# Altium project Multimeter-PCB.PrjPcb
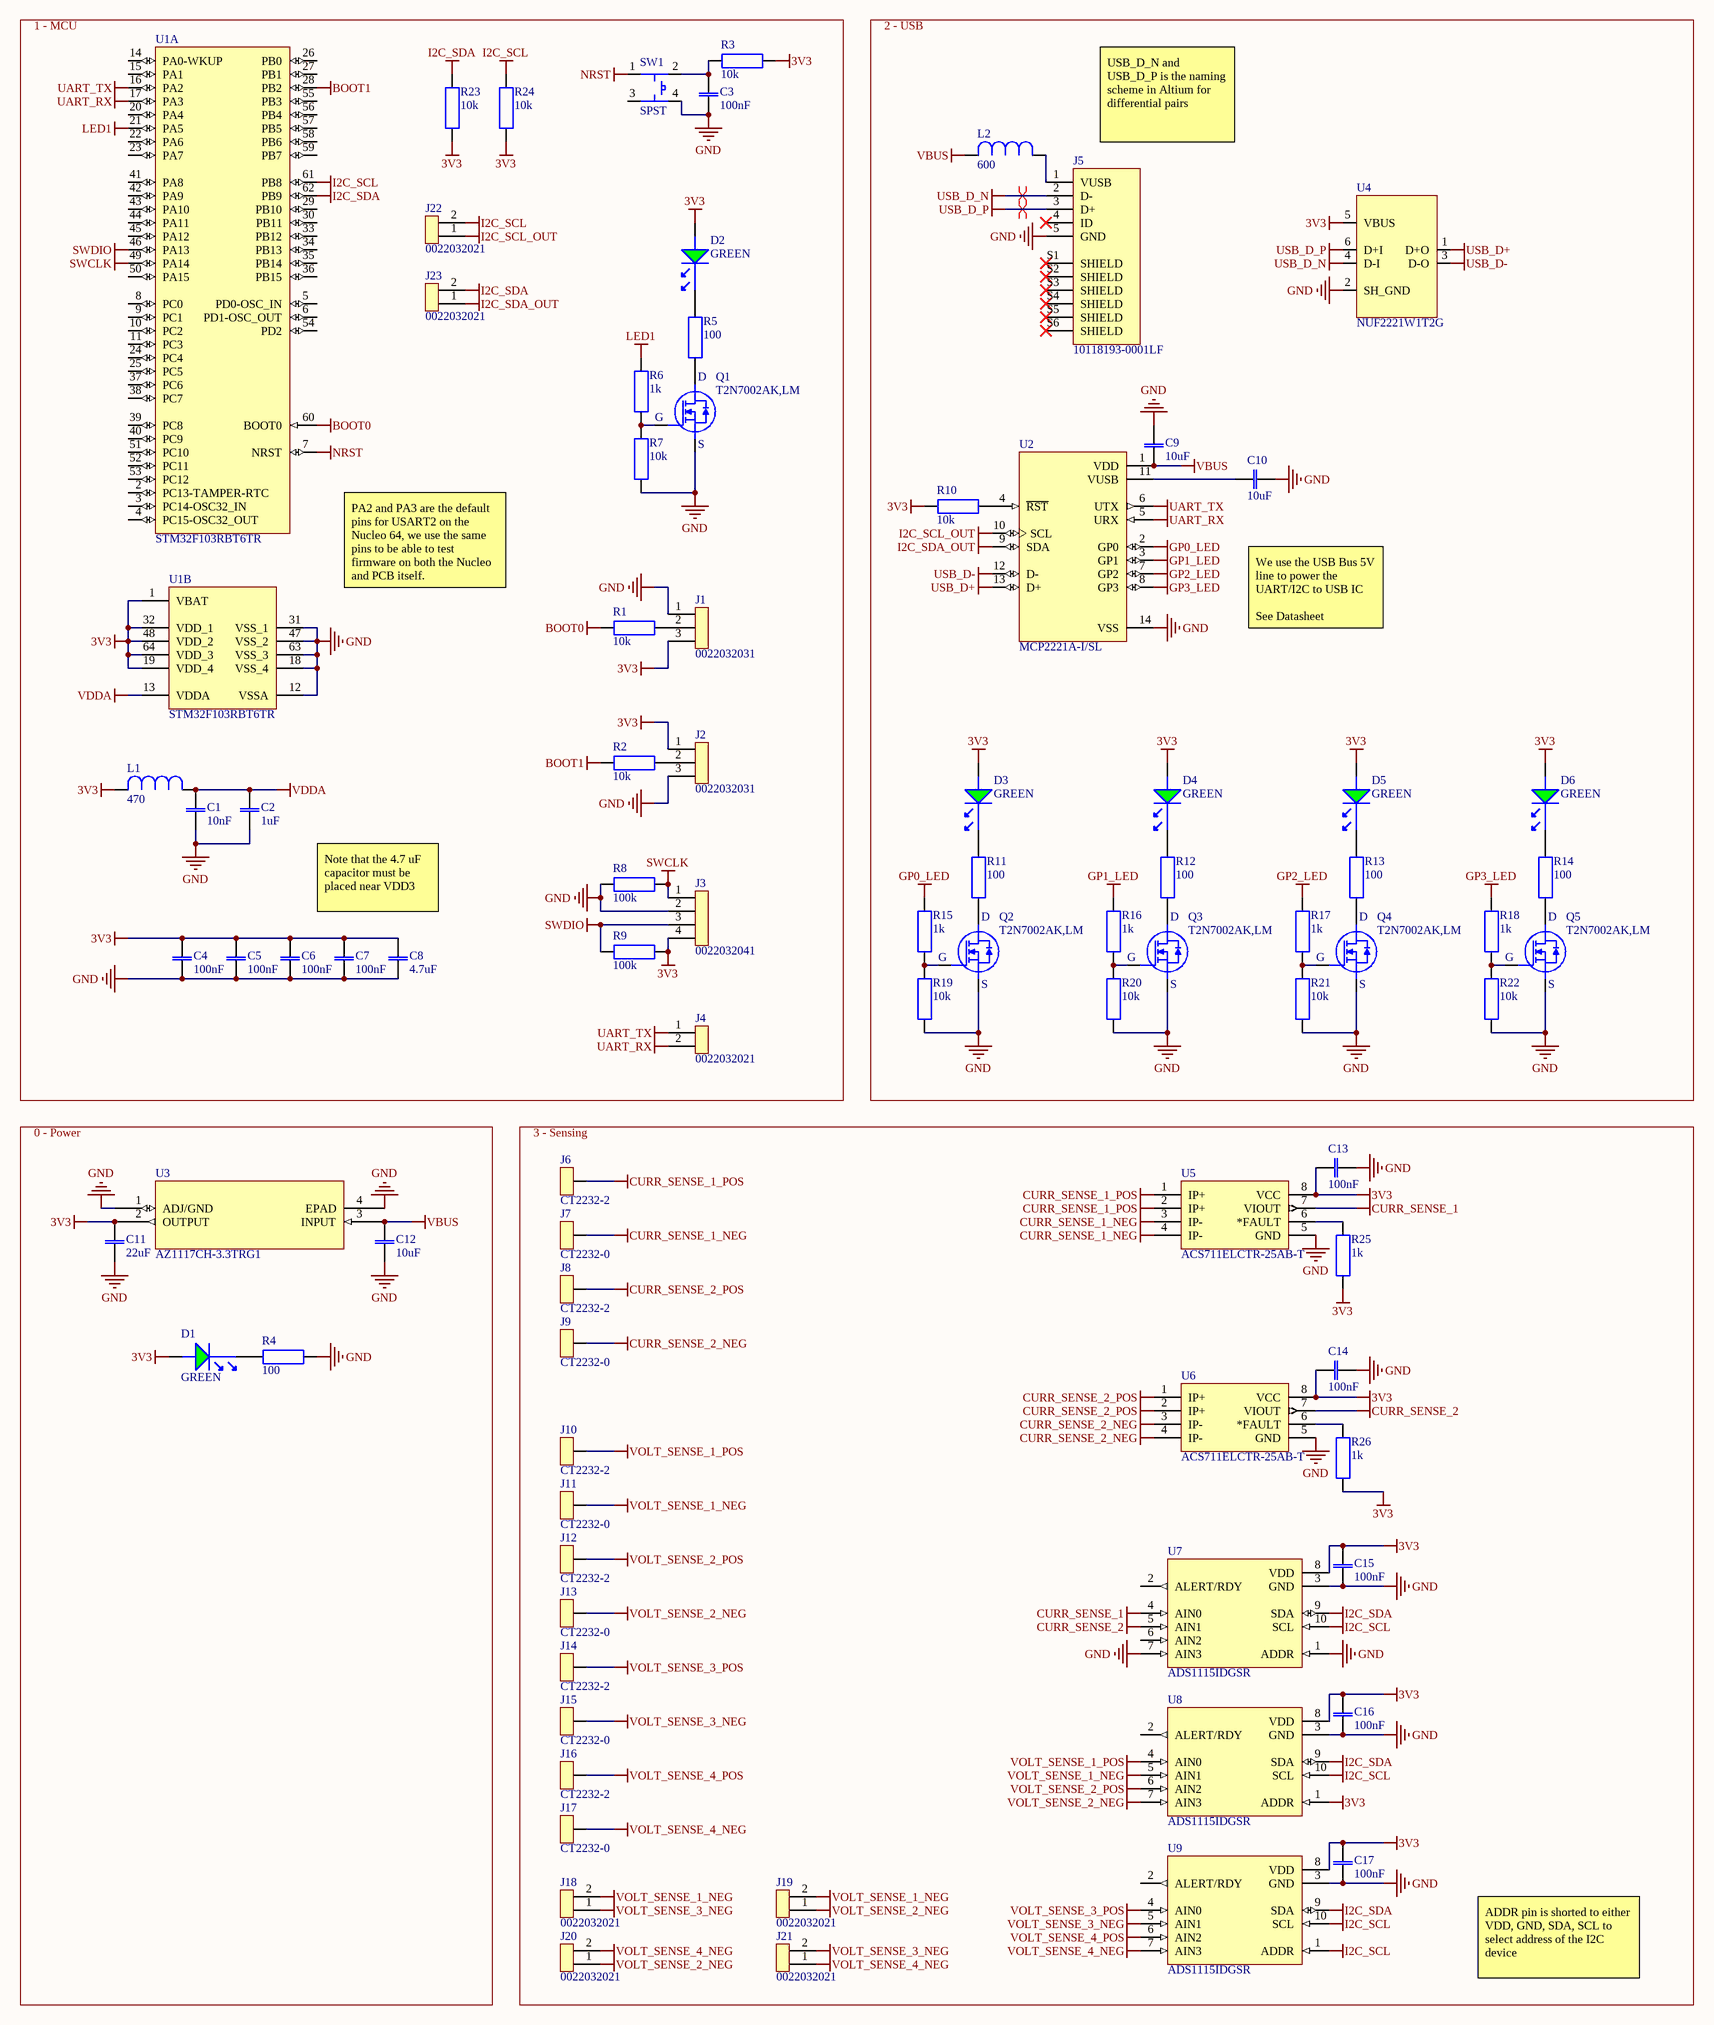
[diagram p0: Multimeter_Schematic.SchDoc]
1 sheet, 89 parts. Net scope: global (net labels, ports and power ports of the same name join across sheets).
Board file: Multimeter_Schematic.PcbDoc

## Sheet Multimeter_Schematic.SchDoc
size A2; SheetNumber: 1; SheetTotal: 1

### Parts
C1  10nF  [CAP_CC0805_YAG]
C2  1uF  [CAP_CC0805_YAG]
C3  100nF  [CAP_CC0805_YAG]
C4  100nF  [CAP_CC0805_YAG]
C5  100nF  [CAP_CC0805_YAG]
C6  100nF  [CAP_CC0805_YAG]
C7  100nF  [CAP_CC0805_YAG]
C8  4.7uF  [CAP_CC0805_YAG]
C9  10uF  [CAP_CC0805_YAG]
C10  10uF  [CAP_CC0805_YAG]
C11  22uF  [CAP_CC0805_YAG]
C12  10uF  [CAP_CC0805_YAG]
C13  100nF  [CAP_CC0805_YAG]
C14  100nF  [CAP_CC0805_YAG]
C15  100nF  [CAP_CC0805_YAG]
C16  100nF  [CAP_CC0805_YAG]
C17  100nF  [CAP_CC0805_YAG]
D1  GREEN  [LTST-C170TGKT]
D2  GREEN  [LTST-C170TGKT]
D3  GREEN  [LTST-C170TGKT]
D4  GREEN  [LTST-C170TGKT]
D5  GREEN  [LTST-C170TGKT]
D6  GREEN  [LTST-C170TGKT]
J1  0022032031  [CONN3X1_22032031_MOL]
J2  0022032031  [CONN3X1_22032031_MOL]
J3  0022032041  [CONN3X1_22032041_MOL]
J4  0022032021  [CONN3X1_22032021_MOL]
J5  10118193-0001LF  [AMPHENOL_10118193-0001LF]
J6  CT2232-2  [CT2232-2]
J7  CT2232-0  [CT2232-0]
J8  CT2232-2  [CT2232-2]
J9  CT2232-0  [CT2232-0]
J10  CT2232-2  [CT2232-2]
J11  CT2232-0  [CT2232-0]
J12  CT2232-2  [CT2232-2]
J13  CT2232-0  [CT2232-0]
J14  CT2232-2  [CT2232-2]
J15  CT2232-0  [CT2232-0]
J16  CT2232-2  [CT2232-2]
J17  CT2232-0  [CT2232-0]
J18  0022032021  [CONN3X1_22032021_MOL]
J19  0022032021  [CONN3X1_22032021_MOL]
J20  0022032021  [CONN3X1_22032021_MOL]
J21  0022032021  [CONN3X1_22032021_MOL]
J22  0022032021  [CONN3X1_22032021_MOL]
J23  0022032021  [CONN3X1_22032021_MOL]
L1  470  [IND_HZ0805G471R-10]
L2  600  [IND_HZ0805G471R-10]
Q1  T2N7002AK,LM  [T2N7002AK,LM]
Q2  T2N7002AK,LM  [T2N7002AK,LM]
Q3  T2N7002AK,LM  [T2N7002AK,LM]
Q4  T2N7002AK,LM  [T2N7002AK,LM]
Q5  T2N7002AK,LM  [T2N7002AK,LM]
R1  10k  [RESC2012X60N]
R2  10k  [RESC2012X60N]
R3  10k  [RESC2012X60N]
R4  100  [RESC2012X60N]
R5  100  [RESC2012X60N]
R6  1k  [RESC2012X60N]
R7  10k  [RESC2012X60N]
R8  100k  [RESC2012X60N]
R9  100k  [RESC2012X60N]
R10  10k  [RESC2012X60N]
R11  100  [RESC2012X60N]
R12  100  [RESC2012X60N]
R13  100  [RESC2012X60N]
R14  100  [RESC2012X60N]
R15  1k  [RESC2012X60N]
R16  1k  [RESC2012X60N]
R17  1k  [RESC2012X60N]
R18  1k  [RESC2012X60N]
R19  10k  [RESC2012X60N]
R20  10k  [RESC2012X60N]
R21  10k  [RESC2012X60N]
R22  10k  [RESC2012X60N]
R23  10k  [RESC2012X60N]
R24  10k  [RESC2012X60N]
R25  1k  [RESC2012X60N]
R26  1k  [RESC2012X60N]
SW1  SPST  [SW4-SMD-5.2X5.2X1.5MM]
U1  STM32F103RBT6TR  [STM-LQFP64_V]  (parts A,B of 2)
U2  MCP2221A-I/SL  [SOIC127P600X175-14N]
U3  AZ1117CH-3.3TRG1  [SOT-223_DIO]
U4  NUF2221W1T2G  [SOT-363]
U5  ACS711ELCTR-25AB-T  [SOICN-8_ALM]
U6  ACS711ELCTR-25AB-T  [SOICN-8_ALM]
U7  ADS1115IDGSR  [SOP50P490X110-10N]
U8  ADS1115IDGSR  [SOP50P490X110-10N]
U9  ADS1115IDGSR  [SOP50P490X110-10N]

### Blocks framed on the sheet
1 - MCU: C1-C8 D2 J1-J4 J22 J23 L1 Q1 R1-R3 R5-R9 R23 R24 SW1 U1
2 - USB: C9 C10 D3-D6 J5 L2 Q2-Q5 R10-R22 U2 U4
0 - Power: C11 C12 D1 R4 U3
3 - Sensing: C13-C17 J6-J21 R25 R26 U5-U9

### Nets
3V3: C4.2 C5.1 C6.1 C7.1 C8.2 C11.2 C13.2 C14.2 C15.2 C16.2 C17.2 D1.1 D2.1 D3.1 D4.1 D5.1 D6.1 J1.3 J2.1 J3.4 L1.2 R3.2 R9.1 R10.1 R23.2 R24.1 R25.1 R26.1 U1.1(VBAT) U1.19(VDD_4) U1.32(VDD_1) U1.48(VDD_2) U1.64(VDD_3) U3.2(OUTPUT) U4.5(VBUS) U5.8(VCC) U6.8(VCC) U7.8(VDD) U8.1(ADDR) U8.8(VDD) U9.8(VDD)
BOOT0: R1.1 U1.60(BOOT0)
BOOT1: R2.1 U1.28(PB2)
CURR_SENSE_1: U5.7(VIOUT) U7.4(AIN0)
CURR_SENSE_1_NEG: J7.1 U5.3(IP-) U5.4(IP-)
CURR_SENSE_1_POS: J6.1 U5.1(IP+) U5.2(IP+)
CURR_SENSE_2: U6.7(VIOUT) U7.5(AIN1)
CURR_SENSE_2_NEG: J9.1 U6.3(IP-) U6.4(IP-)
CURR_SENSE_2_POS: J8.1 U6.1(IP+) U6.2(IP+)
GND: C1.1 C2.1 C3.1 C4.1 C5.2 C6.2 C7.2 C8.1 C9.2 C10.2 C11.1 C12.1 C13.1 C14.1 C15.1 C16.1 C17.1 J1.1 J2.3 J3.2 J5.5(GND) Q1.2 Q2.2 Q3.2 Q4.2 Q5.2 R4.1 R7.1 R8.2 R19.1 R20.1 R21.1 R22.1 SW1.4 U1.12(VSSA) U1.18(VSS_4) U1.31(VSS_1) U1.47(VSS_2) U1.63(VSS_3) U2.14(VSS) U3.1(ADJ/GND) U3.4(EPAD) U4.2(SH_GND) U5.5(GND) U6.5(GND) U7.1(ADDR) U7.3(GND) U7.7(AIN3) U8.3(GND) U9.3(GND)
GP0_LED: R15.2 U2.2(GP0)
GP1_LED: R16.2 U2.3(GP1)
GP2_LED: R17.2 U2.7(GP2)
GP3_LED: R18.2 U2.8(GP3)
I2C_SCL: J22.2 R24.2 U1.61(PB8) U7.10(SCL) U8.10(SCL) U9.1(ADDR) U9.10(SCL)
I2C_SCL_OUT: J22.1 U2.10(SCL)
I2C_SDA: J23.2 R23.1 U1.62(PB9) U7.9(SDA) U8.9(SDA) U9.9(SDA)
I2C_SDA_OUT: J23.1 U2.9(SDA)
LED1: R6.2 U1.21(PA5)
NRST: SW1.1 U1.7(NRST)
SWCLK: J3.1 R8.1 U1.49(PA14)
SWDIO: J3.3 R9.2 U1.46(PA13)
UART_RX: J4.2 U1.17(PA3) U2.5(URX)
UART_TX: J4.1 U1.16(PA2) U2.6(UTX)
USB_D+: U2.13(D+) U4.1(D+O)
USB_D-: U2.12(D-) U4.3(D-O)
USB_D_N: J5.2(D-) U4.4(D-I)
USB_D_P: J5.3(D+) U4.6(D+I)
VBUS: C9.1 C12.2 L2.2 U2.1(VDD) U3.3(INPUT)
VDDA: C1.2 C2.2 L1.1 U1.13(VDDA)
VOLT_SENSE_1_NEG: J11.1 J18.2 J19.2 U8.5(AIN1)
VOLT_SENSE_1_POS: J10.1 U8.4(AIN0)
VOLT_SENSE_2_NEG: J13.1 J19.1 J20.1 U8.7(AIN3)
VOLT_SENSE_2_POS: J12.1 U8.6(AIN2)
VOLT_SENSE_3_NEG: J15.1 J18.1 J21.2 U9.5(AIN1)
VOLT_SENSE_3_POS: J14.1 U9.4(AIN0)
VOLT_SENSE_4_NEG: J17.1 J20.2 J21.1 U9.7(AIN3)
VOLT_SENSE_4_POS: J16.1 U9.6(AIN2)
NetC3_2: C3.2 R3.1 SW1.2
NetC10_1: C10.1 U2.11(VUSB)
NetD1_2: D1.2 R4.2
NetD2_2: D2.2 R5.2
NetD3_2: D3.2 R11.2
NetD4_2: D4.2 R12.2
NetD5_2: D5.2 R13.2
NetD6_2: D6.2 R14.2
NetJ1_2: J1.2 R1.2
NetJ2_2: J2.2 R2.2
NetJ5_1: J5.1(VUSB) L2.1
NetQ1_1: Q1.1 R6.1 R7.2
NetQ1_3: Q1.3 R5.1
NetQ2_1: Q2.1 R15.1 R19.2
NetQ2_3: Q2.3 R11.1
NetQ3_1: Q3.1 R16.1 R20.2
NetQ3_3: Q3.3 R12.1
NetQ4_1: Q4.1 R17.1 R21.2
NetQ4_3: Q4.3 R13.1
NetQ5_1: Q5.1 R18.1 R22.2
NetQ5_3: Q5.3 R14.1
NetR10_2: R10.2 U2.4(~{RST})
NetR25_2: R25.2 U5.6(*FAULT)
NetR26_2: R26.2 U6.6(*FAULT)

Not connected (* = marked no-connect by the designer): J5 4(ID)* S1(SHIELD)* S2(SHIELD)* S3(SHIELD)* S4(SHIELD)* S5(SHIELD)* S6(SHIELD)*; SW1 3; U1 2(PC13-TAMPER-RTC) 3(PC14-OSC32_IN) 4(PC15-OSC32_OUT) 5(PD0-OSC_IN) 6(PD1-OSC_OUT) 8(PC0) 9(PC1) 10(PC2) 11(PC3) 14(PA0-WKUP) 15(PA1) 20(PA4) 22(PA6) 23(PA7) 24(PC4) 25(PC5) 26(PB0) 27(PB1) 29(PB10) 30(PB11) 33(PB12) 34(PB13) 35(PB14) 36(PB15) 37(PC6) 38(PC7) 39(PC8) 40(PC9) 41(PA8) 42(PA9) 43(PA10) 44(PA11) 45(PA12) 50(PA15) 51(PC10) 52(PC11) 53(PC12) 54(PD2) 55(PB3) 56(PB4) 57(PB5) 58(PB6) 59(PB7); U7 2(ALERT/RDY) 6(AIN2); U8 2(ALERT/RDY); U9 2(ALERT/RDY)

### Layout directives
differential pair: USB_D_N, USB_D_P

### Notes on the sheet
- USB_D_N and USB_D_P is the naming scheme in Altium for differential pairs
- PA2 and PA3 are the default pins for USART2 on the Nucleo 64, we use the same pins to be able to test firmware on both the Nucleo and PCB itself.
- We use the USB Bus 5V line to power the UART/I2C to USB IC
  See Datasheet
- Note that the 4.7 uF capacitor must be placed near VDD3
- ADDR pin is shorted to either VDD, GND, SDA, SCL to select address of the I2C device
- (in symbol T2N7002AK,LM) D; G; S

### Library data of the parts
C1 = CC0805KRX7R8BB103: 10000 pF ±10% 25V Ceramic Capacitor X7R 0805 (2012 Metric); Manufacturer: YAGEO; Supplier: Digikey; Supplier Part Number: 311-3579-2-ND; Manufacturer Part Number: CC0805KRX7R8BB103
C2 = CC0805KKX7R8BB105: 1 µF ±10% 25V Ceramic Capacitor X7R 0805 (2012 Metric); Manufacturer: YAGEO; Supplier: Digikey; Supplier Part Number: 311-1456-2-ND; Manufacturer Part Number: CC0805KKX7R8BB105
C3-C7 C13-C17 = CC0805KRX7R8BB104: 0.1 µF ±10% 25V Ceramic Capacitor X7R 0805 (2012 Metric); Manufacturer: YAGEO; Supplier: Digikey; Supplier Part Number: 311-1141-2-ND; Manufacturer Part Number: CC0805KRX7R8BB104
C8 = CC0805KKX7R8BB475: 4.7 µF ±10% 25V Ceramic Capacitor X7R 0805 (2012 Metric); Manufacturer: YAGEO; Supplier: Digikey; Supplier Part Number: 311-1885-2-ND; Manufacturer Part Number: CC0805KKX7R8BB475
C9 C10 C12 = CC0805KKX5R8BB106: 10 µF ±10% 25V Ceramic Capacitor X5R 0805 (2012 Metric); Manufacturer: YAGEO; Supplier: Digikey; Supplier Part Number: 311-1869-2-ND; Manufacturer Part Number: CC0805KKX5R8BB106
C11 = CC0805MKX5R8BB226: 22 µF ±20% 25V Ceramic Capacitor X5R 0805 (2012 Metric); Manufacturer: YAGEO; Supplier: Digikey; Supplier Part Number: 311-1903-2-ND; Manufacturer Part Number: CC0805MKX5R8BB226
D1-D6 = LTST-C170TGKT: Green 525nm LED Indication - Discrete 3.2V 0805 (2012 Metric); Manufacturer: Lite-On Inc.; ComponentLink1Description: Digikey; ComponentLink1URL: https://www.digikey.ca/en/products/detail/liteon/LTST-C190KFKT/386813; Supplier: Digikey; Supplier Part Number: 160-1887-2-ND; Manufacturer Part Number: LTST-C170TGKT
J1 J2 = 0022032031: Connector Header Through Hole 3 position 0.100" (2.54mm); Manufacturer: Molex; Supplier: Digikey; Supplier Part Number: 900-0022032031-ND; Manufacturer Part Number: 0022032031
J3 = 0022032041: Connector Header Through Hole 4 position 0.100" (2.54mm); Manufacturer: Molex; Supplier: Digikey; Supplier Part Number: WM4002-ND; Manufacturer Part Number: 0022032041
J4 J18-J23 = 0022032021: Connector Header Through Hole 2 position 0.100" (2.54mm); Manufacturer: Molex; Supplier: Digikey; Supplier Part Number: WM4000-ND; Manufacturer Part Number: 0022032021
J5 = 10118193-0001LF: USB - micro B USB 2.0 Receptacle Connector 5 Position Surface Mount, Right Angle; Through Hole; Manufacturer: Amphenol ICC (FCI); MF: Amphenol ICC; SnapEDA_Link: https://www.snapeda.com/parts/10118193-0001LF/Amphenol+FCI/view-part/?ref=snap; Package: None; MP: 10118193-0001LF; Check_prices: https://www.snapeda.com/parts/10118193-0001LF/Amphenol+FCI/view-part/?ref=eda; Supplier: Digikey; Supplier Part Number: 609-4616-2-ND; Manufacturer Part Number: 10118193-0001LF
J6 J8 J10 J12 J14 J16 = CT2232-2: (Banana) CONN BIND POST KNURLED RED; Manufacturer: Cal Test Electronics; Parameter 4: CT2232-0; Supplier: Digikey; Supplier Part Number: BKCT2232-2-ND
J7 J9 J11 J13 J15 J17 = CT2232-0: (Banana) CONN BIND POST KNURLED BLACK; Manufacturer: Cal Test Electronics; Supplier: Digikey; Supplier Part Number: BKCT2232-0-ND; Parameter 4: CT2232-0
L1 = HZ0805G471R-10: 470 Ohms @ 100 MHz 1 Power, Signal Line Ferrite Bead 0805 (2012 Metric) 1A 200mOhm; Manufacturer: Laird-Signal Integrity Products; Supplier: Digikey; Supplier Part Number: 240-2400-2-ND; Manufacturer Part Number: HZ0805G471R-10
L2 = MI0603J601R-10: 600 Ohms @ 100 MHz 1 Power, Signal Line Ferrite Bead 0603 (1608 Metric) 1A 200mOhm; Manufacturer: Laird-Signal Integrity Products; Supplier: Digikey; Supplier Part Number: 240-2371-2-ND; Manufacturer Part Number: MI0603J601R-10
Q1-Q5 = T2N7002AK,LM: N-Channel 60 V 200mA (Ta) 320mW (Ta) Surface Mount SOT-23-3; Manufacturer: Toshiba Semiconductor and Storage; ComponentLink1Description: Digikey; ComponentLink1URL: https://www.digikey.ca/en/products/detail/toshiba-semiconductor-and-storage/T2N7002AK-LM/5298028; Supplier: Digikey; Supplier Part Number: T2N7002AKLMCT-ND; Manufacturer Part Number: T2N7002AK,LM
R1-R3 R7 R10 R19-R24 = RC0805FR-0710KL: 10 kOhms ±1% 0.125W, 1/8W Chip Resistor 0805 (2012 Metric) Moisture Resistant Thick Film; Manufacturer: YAGEO; Supplier: Digikey; Supplier Part Number: 311-10.0KCRTR-ND; Manufacturer Part Number: RC0805FR-0710KL
R4 R5 R11-R14 = RC0805FR-07100RL: 100 Ohms ±1% 0.125W, 1/8W Chip Resistor 0805 (2012 Metric) Moisture Resistant Thick Film; Manufacturer: YAGEO; Supplier: Digikey; Supplier Part Number: 311-100CRTR-ND; Manufacturer Part Number: RC0805FR-07100RL
R6 R15-R18 R25 R26 = RC0805FR-071KL: 1 kOhms ±1% 0.125W, 1/8W Chip Resistor 0805 (2012 Metric) Moisture Resistant Thick Film; Manufacturer: YAGEO; Supplier: Digikey; Supplier Part Number: 311-1.00KCRTR-ND; Manufacturer Part Number: RC0805FR-071KL
R8 R9 = RC0805FR-07100KL: 100 kOhms ±1% 0.125W, 1/8W Chip Resistor 0805 (2012 Metric) Moisture Resistant Thick Film; Manufacturer: YAGEO; Supplier: Digikey; Supplier Part Number: 311-100KCRTR-ND; Manufacturer Part Number: RC0805FR-07100KL
SW1 = SPST: Tactile Switch SPST-NO Top Actuated Surface Mount; Manufacturer: Alps Alpine; Manufacturer Part Numbe: SKQGADE010; Supplier: Digikey; Supplier Part Numbr: 4809-SKQGADE010TR-ND
U1 = CMP-0237-00169-4: ARM Cortex-M3 32-bit MCU, 128 KB Flash, 20 KB Internal RAM, 51 I/Os, 64-pin LQFP, -40 to 85 degC, Tape and Reel; Operating Frequency(F) (Processor speed) (MHz): 72; Internal RAM Size (kB): 20; I/Os (High Current): 51; FLASH Size (Prog) (kB): 128; Supply Voltage(Vcc) min (V): 2; A/D Converter: 2x12-bit (16 Channel); ComponentLink3URL: http://www.st.com/st-web-ui/static/active/en/resource/technical/document/datasheet/DM00037051.pdf; ComponentLink2Description: Datasheet; PackageDescription: 64-Pin Low Profile Quad Flat Package, 10 x 10 mm Body, 0.5 mm Pitch; ComponentLink3Description: Package Specification; Mounting Technology: Surface Mount; ComponentLink1Description: Manufacturer URL; DatasheetVersion: Rev. 16; PackageReference: LQFP64; PartNumber: STM32F103RBT6TR; Core: ARM Cortex-M3; ComponentLink2URL: http://www.st.com/st-web-ui/static/active/en/resource/technical/document/datasheet/CD00161566.pdf; ComponentLink1URL: http://www.st.com/web/en/home.html; PackageVersion: Rev. 4, 06/2013; Packing: Tape and Reel
U2 = MCP2221A-I/SL: USB Bridge, USB to I2C/UART USB 2.0 I2C, UART Interface 14-SOIC; Manufacturer: Microchip Technology; Supplier: Digikey; Supplier Part Number: MCP2221A-I/SL-ND; Manufacturer Part Number: MCP2221A-I/SL
U3 = AZ1117CH-3.3TRG1: Linear Voltage Regulator IC Positive Fixed 1 Output 1A SOT-223-3; Manufacturer: Diodes Incorporated; Supplier: Digikey; Supplier Part Number: AZ1117CH-3.3TRG1DITR-ND; Manufacturer Part Number: AZ1117CH-3.3TRG1
U4 = NUF2221W1T2G: RC (Pi) EMI Filter 2nd Order Low Pass 3 Channel R = 22Ohms, C = 42pF (Total) 6-TSSOP, SC-88, SOT-363; Manufacturer: onsemi; Supplier: Digikey; Supplier Part Number: NUF2221W1T2GOSTR-ND; Manufacturer Part Number: NUF2221W1T2G
U5 U6 = ACS711ELCTR-25AB-T: Current Sensor 25A 1 Channel Hall Effect, Open Loop Bidirectional 8-SOIC (0.154", 3.90mm Width); Manufacturer: *Allegro MicroSystems; Supplier: Digikey; Supplier Part Numebr: 620-1371-2-ND; Manufacturer Part Number: ACS711ELCTR-25AB-T
U7-U9 = ADS1115IDGSR: 16 Bit Analog to Digital Converter 2, 4 Input 1 Sigma-Delta 10-VSSOP; Manufacturer: Texas Instruments; Supplier: Digikey; Supplier Part Number: 296-38849-2-ND; Manufacturer Part Number: ADS1115IDGSR